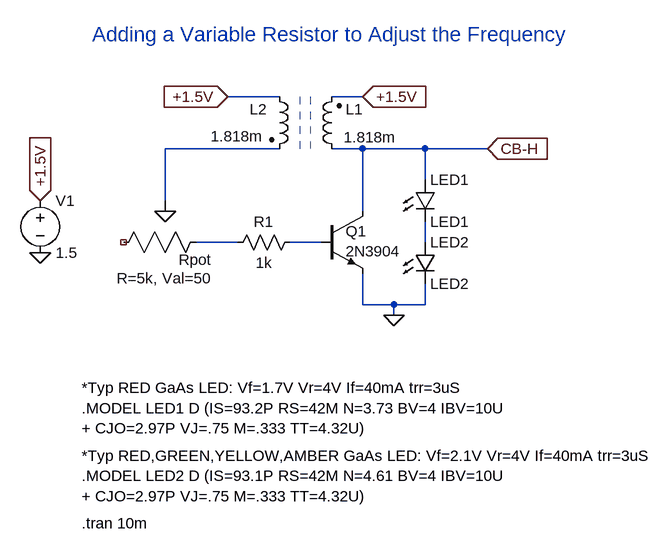
[diagram p0: schematic adding_var_res_to_adjust_freq_ltspice.asc]
adding_var_res_to_adjust_freq_ltspice.asc, the LTspice schematic file:
Version 4
SHEET 1 880 876
WIRE 144 160 64 160
WIRE 272 160 224 160
WIRE 144 240 -32 240
WIRE 272 240 224 240
WIRE 368 240 272 240
WIRE 464 240 368 240
WIRE 368 288 368 240
WIRE -32 320 -32 240
WIRE 272 336 272 240
WIRE 80 384 16 384
WIRE 208 384 160 384
WIRE 368 384 368 352
WIRE 272 480 272 432
WIRE 320 480 272 480
WIRE 368 480 368 448
WIRE 368 480 320 480
WIRE 320 496 320 480
FLAG 64 160 +1.5V
IOPIN 64 160 In
FLAG 272 160 +1.5V
IOPIN 272 160 In
FLAG 320 496 0
FLAG 464 240 CB-H
IOPIN 464 240 In
FLAG -224 320 +1.5V
IOPIN -224 320 In
FLAG -224 400 0
SYMBOL ind2 240 256 R180
WINDOW 0 -33 77 Left 2
WINDOW 3 -3 34 Right 2
SYMATTR InstName L1
SYMATTR Value 1.818m
SYMATTR Type ind
SYMBOL ind2 128 144 R0
WINDOW 0 -30 35 Left 2
WINDOW 3 -90 77 Left 2
SYMATTR InstName L2
SYMATTR Value 1.818m
SYMATTR Type ind
SYMBOL LED 352 288 R0
SYMATTR InstName LED1
SYMATTR Value LED1
SYMBOL LED 352 384 R0
SYMATTR InstName LED2
SYMATTR Value LED2
SYMBOL npn 208 336 R0
WINDOW 0 38 31 Left 2
WINDOW 3 38 62 Left 2
SYMATTR InstName Q1
SYMATTR Value 2N3904
SYMBOL res 176 368 R90
WINDOW 0 0 56 VBottom 2
WINDOW 3 32 56 VTop 2
SYMATTR InstName R1
SYMATTR Value 1k
SYMBOL potentiometer 0 368 R90
WINDOW 0 43 -40 VRight 2
WINDOW 39 71 -40 VRight 2
SYMATTR InstName Rpot
SYMATTR SpiceLine R=5k, Val=50
SYMBOL voltage -224 304 R0
SYMATTR InstName V1
SYMATTR Value 1.5
TEXT -144 64 Left 3 ;Adding a Variable Resistor to Adjust the Frequency
TEXT -160 608 Left 2 !*Typ RED GaAs LED: Vf=1.7V Vr=4V If=40mA trr=3uS\n.MODEL LED1 D (IS=93.2P RS=42M N=3.73 BV=4 IBV=10U\n+ CJO=2.97P VJ=.75 M=.333 TT=4.32U)
TEXT -160 712 Left 2 !*Typ RED,GREEN,YELLOW,AMBER GaAs LED: Vf=2.1V Vr=4V If=40mA trr=3uS\n.MODEL LED2 D (IS=93.1P RS=42M N=4.61 BV=4 IBV=10U\n+ CJO=2.97P VJ=.75 M=.333 TT=4.32U)
TEXT -160 816 Left 2 !.tran 10m
LINE Normal 176 240 176 160 2
LINE Normal 192 240 192 160 2

The netlist it stands for:
* adding_var_res_to_adjust_freq_ltspice.asc
L1 CB-H +1.5V 1.818m
L2 +1.5V N001 1.818m
D§LED1 CB-H N004 LED1
D§LED2 N004 0 LED2
Q1 CB-H N003 0 0 2N3904
R1 N003 N002 1k
XRpot N002 N001 NC_01 potentiometer R=5k, Val=50  ; pins 1 2 3
V1 +1.5V 0 1.5
.model D D
.lib standard.dio
.model NPN NPN
.model PNP PNP
.lib standard.bjt
* Adding a Variable Resistor to Adjust the Frequency
*Typ RED GaAs LED: Vf=1.7V Vr=4V If=40mA trr=3uS
.MODEL LED1 D (IS=93.2P RS=42M N=3.73 BV=4 IBV=10U
+ CJO=2.97P VJ=.75 M=.333 TT=4.32U)
*Typ RED,GREEN,YELLOW,AMBER GaAs LED: Vf=2.1V Vr=4V If=40mA trr=3uS
.MODEL LED2 D (IS=93.1P RS=42M N=4.61 BV=4 IBV=10U
+ CJO=2.97P VJ=.75 M=.333 TT=4.32U)
.tran 10m
.backanno
.end